# EAGLE design MB_Relay_active_high (EAGLE 9.4.2)
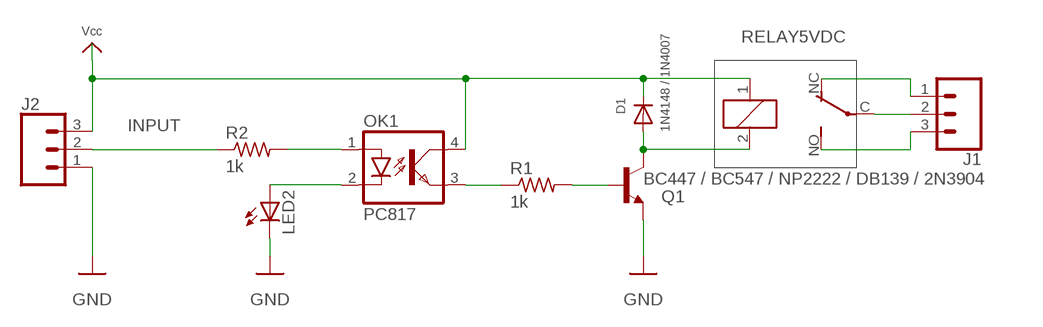
[diagram p0: schematic, sheet 1]

## Parts
D1  1N4148 / 1N4007  DIODEDO-1N4148  [DO-1N4148]
J1  CONN_03  [1X03]
J2  CONN_03  [1X03]
LED2  LED3MM  [LED3MM]
OK1  PC817  [DIL04]
Q1  BC447 / BC547 / NP2222 / DB139 / 2N3904  BC447  [TO92-EBC]
R1  1k  R-US_0204/7  [0204/7]
R2  1k  R-US_0204/7  [0204/7]
RELAY5VDC  RELAY 5VDC  CQ1-12V  [CQ1]

## Nets
GND: J2.1 LED2.K(C) Q1.E
INPUT: J2.2 R2.1
N$1: OK1.1(A) R2.2
N$2: LED2.A OK1.2(C)
N$3: OK1.3(EMIT) R1.1
N$4: D1.A Q1.C RELAY5VDC.2
N$6: J1.1 RELAY5VDC.NC(2:O)
N$7: J1.3 RELAY5VDC.NO(2:S)
N$8: J1.2 RELAY5VDC.C(2:P)
N$11: Q1.B R1.2
RELAY_POWER_5V: D1.C J2.3 OK1.4(COL) RELAY5VDC.1 ; supply symbol labelled Vcc

## Library data of the parts
D1 = adafruit:DIODE: Diode SMADIODE - SMA Surface Mount Package 20V 1A Schottky Diode Digikey: 641-1014-6-ND DO-1N4148 - Through Hole Small Current Diode SOD-123 20V 1 A (.5mV Vf) Schottky Diode - Digikey: MBRX120TPMSCT-ND SOD-323 10V 570mA (.38mV Vf, 3ns) Schottky Diode - Digikey: ZLLS410CT-ND SOD-523 30V 30mA Schottky Diode (RB751S-40TE61) - Digikey: RB751S-40TE61CT-ND SOT23-R/W - SOT23 Package (R = Solder Paste/Reflow Ovens, W = Hand-Soldering) BAT54Film 40V 300mA - Digikey: 497-7162-1-ND
J1 J2 = SparkFun-Connectors:CONN_03: Multi connection point. Often used as Generic Header-pin footprint for 0.1 inch spaced/style header connections On any of the 0.1 inch spaced packages, you can populate with these: Break Away Headers - Straight <https://www.sparkfun.com/products/116> (PRT-00116) Break Away Male Headers - Right Angle <https://www.sparkfun.com/products/553> (PRT-00553) Female Headers <https://www.sparkfun.com/products/115> (PRT-00115) Break Away Headers - Machine Pin <https://www.sparkfun.com/products/117> (PRT-00117) Break Away Female Headers - Swiss Machine Pin <https://www.sparkfun.com/products/743> (PRT-00743) Stackable Header - 3 Pin (Female, 0.1") <https://www.sparkfun.com/products/13875> (PRT-13875) For SCREWTERMINALS and SPRING TERMINALS visit here: Screw Terimnals on SparkFun.com <https://www.sparkfun.com/search/results?term=Screw+Terminals> (5mm/3.5mm/2.54mm spacing) This device is also useful as a general connection point to wire up your design to another part of your project. Our various solder wires solder well into these plated through hole pads. Hook-Up Wire - Assortment (Stranded, 22 AWG) <https://www.sparkfun.com/products/11375> (PRT-11375) Hook-Up Wire - Assortment (Solid Core, 22 AWG) <https://www.sparkfun.com/products/11367> (PRT-11367) View the entire wire category on our website here <https://www.sparkfun.com/categories/141> Special notes: Molex polarized connector foot print use with SKU : PRT-08232 with associated crimp pins and housings.
LED2 = adafruit:LED: LED OSRAM: - CHIPLED LG R971, LG N971, LY N971, LG Q971, LY Q971, LO R971, LY R971 LH N974, LH R974 LS Q976, LO Q976, LY Q976 LO Q996 - Hyper CHIPLED LW Q18S LB Q993, LB Q99A, LB R99A - SideLED LS A670, LO A670, LY A670, LG A670, LP A670 LB A673, LV A673, LT A673, LW A673 LH A674 LY A675 LS A676, LA A676, LO A676, LY A676, LW A676 LS A679, LY A679, LG A679 - Hyper Micro SIDELED® LS Y876, LA Y876, LO Y876, LY Y876 LT Y87S - SmartLED LW L88C, LW L88S LB L89C, LB L89S, LG L890 LS L89K, LO L89K, LY L89K LS L896, LA L896, LO L896, LY L896 - TOPLED LS T670, LO T670, LY T670, LG T670, LP T670 LSG T670, LSP T670, LSY T670, LOP T670, LYG T670 LG T671, LOG T671, LSG T671 LB T673, LV T673, LT T673, LW T673 LH T674 LS T676, LA T676, LO T676, LY T676, LB T676, LH T676, LSB T676, LW T676 LB T67C, LV T67C, LT T67C, LS T67K, LO T67K, LY T67K, LW E67C LS E67B, LA E67B, LO E67B, LY E67B, LB E67C, LV E67C, LT E67C LW T67C LS T679, LY T679, LG T679 LS T770, LO T770, LY T770, LG T770, LP T770 LB T773, LV T773, LT T773, LW T773 LH T774 LS E675, LA E675, LY E675, LS T675 LS T776, LA T776, LO T776, LY T776, LB T776 LHGB T686 LT T68C, LB T68C - Hyper Mini TOPLED® LB M676 - Mini TOPLED Santana® LG M470 LS M47K, LO M47K, LY M47K Source: http://www.osram.convergy.de/
OK1 = optocoupler:PC817: SHARP OPTO COUPLER; MPN: PC817X4J000F; OC_FARNELL: 9707727; OC_NEWARK: 97K7059
Q1 = transistor-npn:BC447*: NPN Transistor
R1 R2 = adafruit:R-US_: RESISTOR, American symbol
RELAY5VDC = relay:CQ1-12V: AUTOMOTIVE QUIET RELAY NAiS Source: http://www.mew-europe.com/.. en_ds_61208_0000.pdf; OC_FARNELL: unknown; OC_NEWARK: unknown

## Board
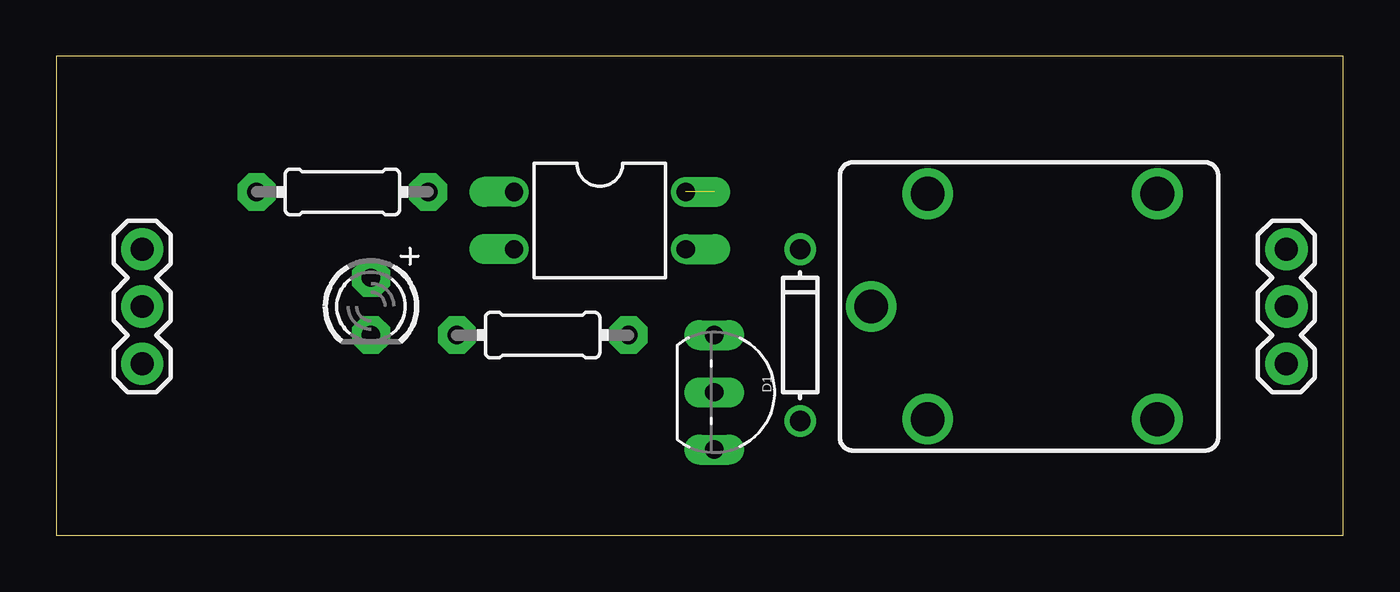
[diagram p1: board, top side]
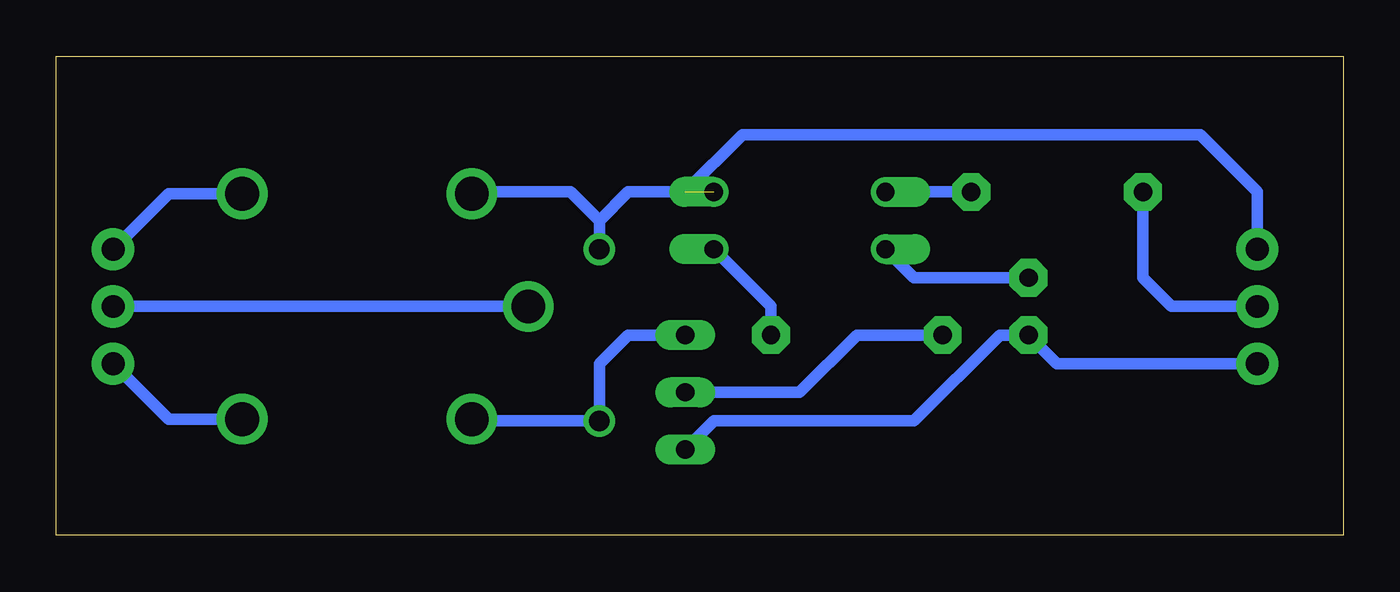
[diagram p2: board, bottom side, seen from below]

Size 57.13 x 21.26 mm. Coordinates in mm from the lower left corner, seen from the top.
Outline: 0,0 57.13,0 57.13,21.26 0,21.26 0,0
Copper layers (1*16): Top 0.035mm / dielectric 1.5mm / Bottom 0.035mm
Design rules "default": minimum track width 6mil, minimum drill 0.35mm, track to track 6mil, track to pad 6mil, pad to pad 6mil, via to via 6mil, smd to smd 6mil, copper to edge 40mil, drill to drill 6mil, minimum pad ring 10mil, minimum via ring 8mil, stop-mask expansion 4mil, vias tented up to drill 0mil, thermal gap 10mil

### Footprints (pad centres in the part's own frame; a part is rotated, then mirrored left to right if it is on the bottom)
DO-1N4148 = drill 0.9: A -3.81,0; C 3.81,0
1X03 = drill 1.016 pad 1.88: 1 0,0; 2 2.54,0; 3 5.08,0
LED3MM = drill 0.813 pad 1.676 octagon: A -1.27,0; K 1.27,0
DIL04 = drill 0.813 offset: 1 -1.27,-3.81; 2 1.27,-3.81; 3 1.27,3.81; 4 -1.27,3.81
TO92-EBC = drill 0.813 long: B 0,-1.27; C -2.54,-1.27; E 2.54,-1.27
0204/7 = drill 0.813 pad 1.676 octagon: 1 -3.81,0; 2 3.81,0
CQ1 = drill 1.5: 1 4.5,-5; 2 4.5,5; C 7,0; NC -5.7,-5; NO -5.7,5

### Placement (x,y rotation side)
D1  33.02,8.89 90 top
J1  54.61,12.7 270 top
J2  3.81,7.62 90 top
LED2  13.97,10.16 270 top
OK1  24.13,13.97 270 top
Q1  30.48,6.35 270 top
R1  21.59,8.89 180 top
R2  12.7,15.24 0 top
RELAY5VDC  43.18,10.16 180 top

### Tracks (layer width: path | path; a pad name or v marks a point on that pad's centre or on a via)
GND
  Bottom 0.508: J2.1 12.7,7.62 LED2.K 15.24,8.89 19.05,5.08 27.94,5.08 Q1.E
INPUT
  Bottom 0.508: R2.1 8.89,11.43 7.62,10.16 J2.2
N$1
  Bottom 0.508: R2.2 OK1.1
N$2
  Bottom 0.508: OK1.2 19.05,11.43 LED2.A
N$3
  Bottom 0.508: OK1.3 25.4,10.16 R1.1
N$4
  Bottom 0.508: 38.76,5.08 D1.A 33.02,7.62 31.75,8.89 Q1.C | RELAY5VDC.2 38.76,5.08 | 38.76,5.08 39.37,5.08
N$6
  Bottom 0.508: RELAY5VDC.NC 52.15,15.16 J1.1
N$7
  Bottom 0.508: J1.3 52.15,5.16 RELAY5VDC.NO
N$8
  Bottom 0.508: RELAY5VDC.C J1.2
N$11
  Bottom 0.508: R1.2 21.59,8.89 24.13,6.35 Q1.B
RELAY_POWER_5V  (1 unrouted)
  Bottom 0.508: 33.02,13.97 31.75,15.24 29.21,15.24 26.67,17.78 6.35,17.78 3.81,15.24 J2.3 | 33.02,13.97 D1.C | 33.02,13.97 34.29,15.24 38.6,15.24 RELAY5VDC.1